# Altium project smps_nuc.PrjPcb
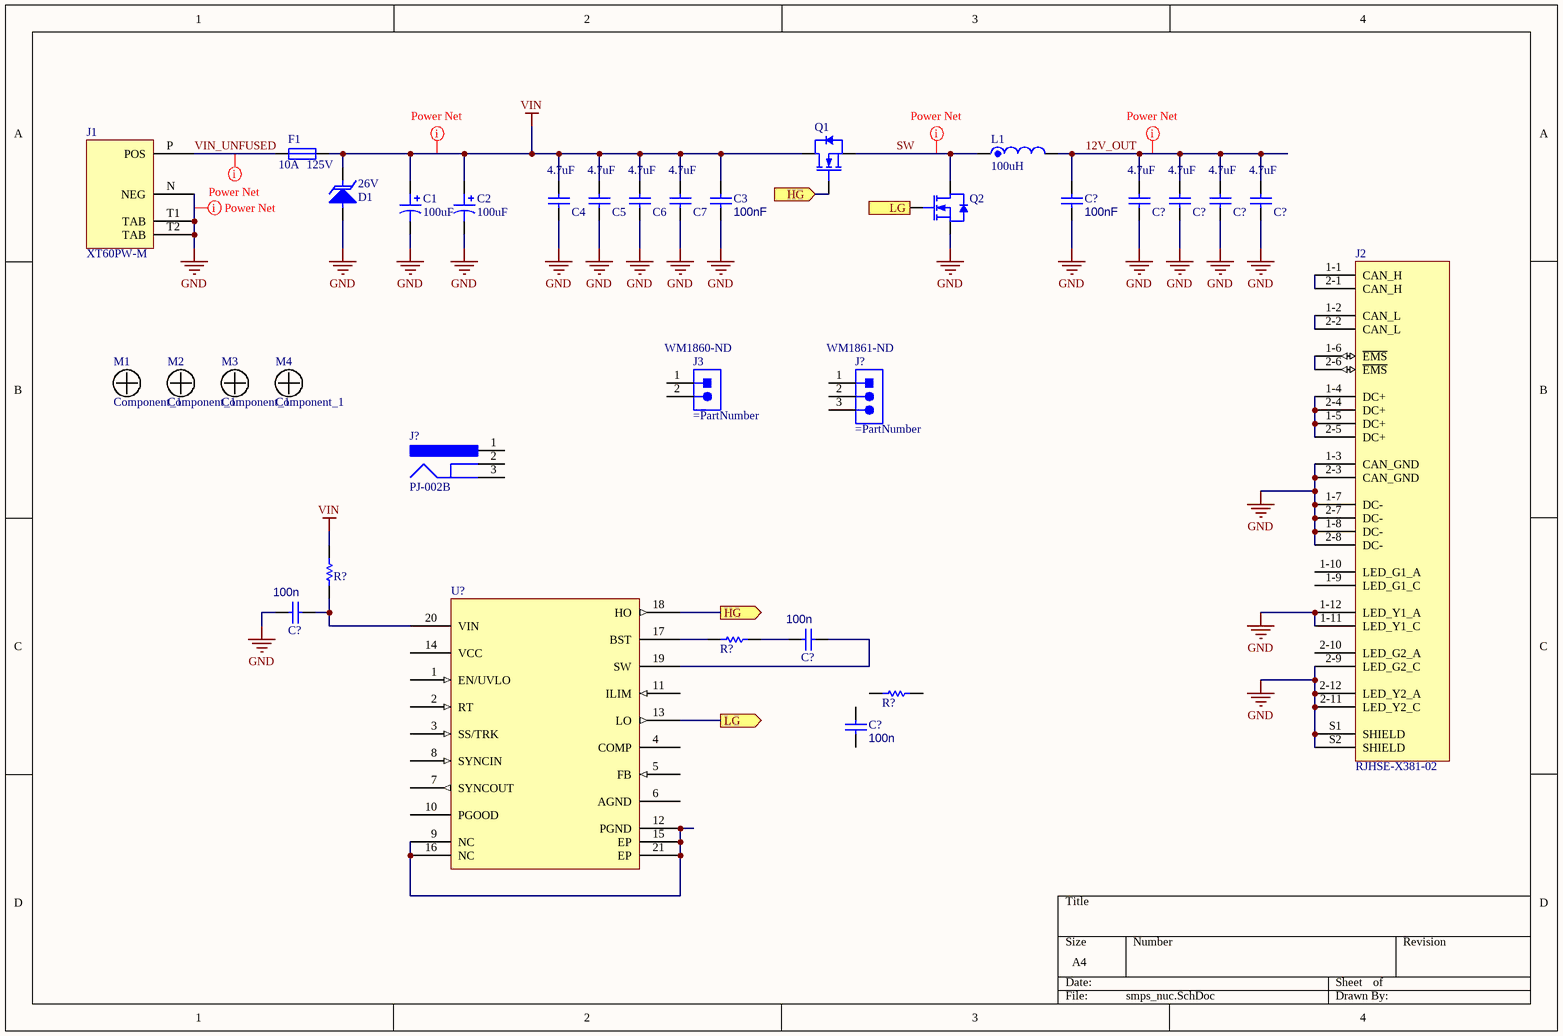
[diagram p0: smps_nuc.SchDoc]
1 sheet, 33 parts. Net scope: flat (ports and power ports of the same name join across sheets).
Board file: smps_nuc.PcbDoc

## Sheet smps_nuc.SchDoc
size A4

### Parts
(Parts that share a designator on the sheet are numbered #1, #2 ... from top to bottom, then left to right.)
C1  100uF  [CPOL_8x11_5_THRU]
C2  100uF  [CPOL_8x11_5_THRU]
C3  value 100nF  [CAPC1608X09N]
C4  Capacitance: 4.7uF  [C1210 (3225M)]
C5  Capacitance: 4.7uF  [C1210 (3225M)]
C6  Capacitance: 4.7uF  [C1210 (3225M)]
C7  Capacitance: 4.7uF  [C1210 (3225M)]
C?#1  Capacitance: 4.7uF  [C1210 (3225M)]
C?#2  Capacitance: 4.7uF  [C1210 (3225M)]
C?#3  Capacitance: 4.7uF  [C1210 (3225M)]
C?#4  Capacitance: 4.7uF  [C1210 (3225M)]
C?#5  value 100nF  [CAPC1608X09N]
C?#6  value 100n  [C1210 (3225M)]
C?#7  value 100n  [C1210 (3225M)]
C?#8  value 100n  [C1210 (3225M)]
D1  Reverse Standoff Voltage: 26V  [SMB]
F1  Fuse Current: 10A  Voltage Rating (AC): 125V  [Littelfuse_157]
J1  XT60PW-M  [XT60PW-M]
J2  RJHSE-X381-02  [RJHSE-X38X-02]
J3  Supplier Part Number 1: WM1860-ND  [43650-020X]
J?#1  Supplier Part Number 1: WM1861-ND  [43650-030X]
J?#2  PJ-002B  [CUI-PJ-002A_V]
L1  100uH  [SRP1265A]
M1  Component_1  [MOUNT_HOLE_3.2]
M2  Component_1  [MOUNT_HOLE_3.2]
M3  Component_1  [MOUNT_HOLE_3.2]
M4  Component_1  [MOUNT_HOLE_3.2]
Q1  MOSFET-N  [DFN-5 (SO-8FL)]  (value not drawn)
Q2  MOSFET-N  [DFN-5 (SO-8FL)]  (value not drawn)
R?#1  (no value)  [CR0603]
R?#2  (no value)  [CR0603]
R?#3  (no value)  [CR0603]
U?  (no value)  [RGY0020B_TI_N]

### Ports
HG (in), HG (out), LG (in), LG (out)

### Nets
GND: C1.2 C2.2 C3.2 C4.1 C5.1 C6.1 C7.1 C?#1.1 C?#2.1 C?#3.1 C?#4.1 C?#5.2 C?#6.2 D1.2(A) J1.N(NEG) J1.T1(TAB) J1.T2(TAB) J2.1-3(CAN_GND) J2.1-7(DC-) J2.1-8(DC-) J2.1-11(LED_Y1_C) J2.1-12(LED_Y1_A) J2.2-3(CAN_GND) J2.2-7(DC-) J2.2-8(DC-) J2.2-9(LED_G2_C) J2.2-11(LED_Y2_C) J2.2-12(LED_Y2_A) J2.S1(SHIELD) J2.S2(SHIELD) Q2.S
VIN: C1.1 C2.1 C3.1 C4.2 C5.2 C6.2 C7.2 D1.1(C) F1.2 Q1.D R?#1.2
12V_OUT: C?#1.2 C?#2.2 C?#3.2 C?#4.2 C?#5.1 L1.2
SW: L1.1 Q1.S Q2.D
VIN_UNFUSED: F1.1 J1.P(POS)
NetC?#6_1: C?#6.1 R?#1.1 U?.20(VIN)
NetC?#7_1: C?#7.1 U?.19(SW)
NetC?#7_2: C?#7.2 R?#2.2
NetJ2_1-1: J2.1-1(CAN_H) J2.2-1(CAN_H)
NetJ2_1-2: J2.1-2(CAN_L) J2.2-2(CAN_L)
NetJ2_1-4: J2.1-4(DC+) J2.1-5(DC+) J2.2-4(DC+) J2.2-5(DC+)
NetJ2_1-6: J2.1-6(~{EMS}) J2.2-6(~{EMS})
NetQ1_G: Q1.G U?.18(HO) ; port HG
NetQ2_G: Q2.G U?.13(LO) ; port LG
NetR?#2_1: R?#2.1 U?.17(BST)
NetU?_9: U?.9(NC) U?.12(PGND) U?.15(EP) U?.16(NC) U?.21(EP)

Not connected (* = marked no-connect by the designer): C?#8 1 2; J2 1-9(LED_G1_C) 1-10(LED_G1_A) 2-10(LED_G2_A); J3 1 2; J?#1 1 2 3; J?#2 1 2 3; R?#3 1 2; U? 1(EN/UVLO) 2(RT) 3(SS/TRK) 4(COMP) 5(FB) 6(AGND) 7(SYNCOUT) 8(SYNCIN) 10(PGOOD) 11(ILIM) 14(VCC)

### Layout directives
net class Power: 12V_OUT, GND, SW, VIN, VIN_UNFUSED

### Library data of the parts
C1 C2 = CPOL
C3 C?#5-C?#8 = C
C4-C7 C?#1-C?#4 = C: Ceramic capacitor 1210 X7R 50V 4.7uF; Manufacturer: Taiyo Yuden; Manufacturer Part Number: UMK325B7475MM-T; Tolerance: 20%; Supplier 1: Avnet; Supplier Part Number 1: UMK325B7475MM-T; RoHS: Yes; Category: Ceramic Capacitors; Pricing 1: 500=0.11860, 1000=0.10876, 2000=0.10029, 3000=0.09316, 5000=0.08688 (USD); Mount: Surface Mount; Case/Package: 1210; Case Code (Metric): 3225; Case Code (Imperial): 1210; Min Operating Temperature: -55°C; Max Operating Temperature: 125°C; Voltage Rating: 50V; Packaging: Tape and Reel; Dielectric: X7R; Voltage Rating (DC): 50V; Termination: SMD/SMT; Package Quantity: 500; Voltage: 50V; Length: 3.2mm; Height: 2.5mm; Width: 0.098inch; Thickness: 0.106inch; Depth: 2.5mm; Radiation Hardening: No; Halogen Free: Halogen Free; Lead Free: Lead Free; REACH SVHC: Unknown; ComponentLink1URL: https://datasheet.ciiva.com/2990/umk325b7475mm-t-ss-2990073.pdf?src-supplier=Avnet; ComponentLink1Description: https://datasheet.ciiva.com/2990/umk325b7475mm-t-ss-2990073.pdf?src-supplier=Avnet; ComponentLink2URL: https://datasheet.ciiva.com/141/umk325b7475mm-t-ss-141867.pdf?src-supplier=Digi-Key; ComponentLink2Description: https://datasheet.ciiva.com/141/umk325b7475mm-t-ss-141867.pdf?src-supplier=Digi-Key; ComponentLink3URL: https://datasheet.ciiva.com/5441/mlcc-all-e-541559-5441759.pdf?src-supplier=Mouser; ComponentLink3Description: https://datasheet.ciiva.com/5441/mlcc-all-e-541559-5441759.pdf?src-supplier=Mouser
D1 = TVS: TVS DIODE 26VWM 42.1VC SMB; Manufacturer: Diodes; Manufacturer Part Number: SMBJ26A-13-F; Clamping Voltage: 42.1V; Peak Pulse Power: 600W; Peak Pulse Current: 14.2A; Min Breakdown Voltage: 28.9V; Test Current: 1mA; Polarity: Unidirectional; Number of Unidirectional Channels: 1; Power Line Protection: No; Breakdown Voltage: 33.2V; Element Configuration: Single; Max Reverse Leakage Current: 5uA; Max Breakdown Voltage: 31.9V; Supplier 1: Digi-Key; RoHS: Yes; Category: TVS Diodes; Stock 1: 5829; Pricing 1: 1=0.41000, 10=0.30800, 25=0.27760, 100=0.14650, 250=0.14492, 500=0.12978, 1000=0.10100 (USD); Mount: Surface Mount; Case/Package: SMB; Number of Pins: 2; Contact Plating: Tin,Matte; Min Operating Temperature: -55°C; Max Operating Temperature: 150°C; Packaging: Tape and Reel; Package Quantity: 3000; Composition: Zener; Direction: Unidirectional; Max Surge Current: 14.2A; Termination: SMD/SMT; Reverse Breakdown Voltage: 28.9V; Leakage Current: 5uA; Number of Elements: 1; Max Power Dissipation: 600W; Voltage Rating (DC): 26V; Power Dissipation: 600W; Working Voltage: 26V; ESD Protection: No; Length: 4.57mm; Height: 2.62mm; Width: 3.9mm; Radiation Hardening: No; Lead Free: Lead Free; ComponentLink1URL: https://datasheet.ciiva.com/15143/getdatasheetpartid-118169-15143570.pdf?src-supplier=Verical; ComponentLink1Description: https://datasheet.ciiva.com/15143/getdatasheetpartid-118169-15143570.pdf?src-supplier=Verical; ComponentLink2URL: https://datasheet.ciiva.com/16211/ds19002-16211003.pdf?src-supplier=Future+Electronics; ComponentLink2Description: https://datasheet.ciiva.com/16211/ds19002-16211003.pdf?src-supplier=Future+Electronics
F1 = Littelfuse_157: FUSE CLIP W/ 10A FUSE, FAST ACTING - More Details; Manufacturer Part Number: 0157010.DR; DC Cold Resistance: 5.8mR; Fuse Type: Board Mount (Cartridge Style Excluded); Approvals: cULus,PSE; Supplier 1: Digi-Key; Supplier Part Number 1: F2973CT-ND; Manufacturer: Littelfuse; RoHS: Yes; Category: Fuses; Stock 1: 8274; Pricing 1: 1=2.73000, 5=2.60000, 10=2.47000, 50=1.99360, 100=1.69030, 250=1.64692, 500=1.38688 (USD); Mount: Surface Mount,Holder; Case/Package: SMD/SMT; Number of Pins: 2; Housing Material: Ceramic; Min Operating Temperature: -55°C; Max Operating Temperature: 125°C; Voltage Rating (DC): 125V; Current Rating: 10A; Packaging: Tape and Reel; Package Quantity: 1500; Resistance: 5.8mR; Length: 6.5mm; Height: 0.154inch; Depth: 3.7mm; Width: 0.146inch; Radiation Hardening: No; REACH SVHC: No SVHC; Lead Free: Lead Free; ComponentLink1URL: https://datasheet.ciiva.com/1221/682285-1221410.pdf?src-supplier=Newark; ComponentLink1Description: https://datasheet.ciiva.com/1221/682285-1221410.pdf?src-supplier=Newark; ComponentLink2URL: https://datasheet.ciiva.com/300/littelfuse-fuse-157-300246.pdf?src-supplier=Digi-Key; ComponentLink2Description: https://datasheet.ciiva.com/300/littelfuse-fuse-157-300246.pdf?src-supplier=Digi-Key; ComponentLink3URL: https://datasheet.ciiva.com/300/littelfuse-fuse-157-300247.pdf?src-supplier=Digi-Key; ComponentLink3Description: https://datasheet.ciiva.com/300/littelfuse-fuse-157-300247.pdf?src-supplier=Digi-Key; ComponentLink4URL: https://datasheet.ciiva.com/1268/479491-1268801.pdf?src-supplier=Element14; ComponentLink4Description: https://datasheet.ciiva.com/1268/479491-1268801.pdf?src-supplier=Element14; ComponentLink5URL: https://datasheet.ciiva.com/1268/littelfuse-fuse-157-1268995.pdf?src-supplier=Element14; ComponentLink5Description: https://datasheet.ciiva.com/1268/littelfuse-fuse-157-1268995.pdf?src-supplier=Element14; ComponentLink6URL: https://datasheet.ciiva.com/1272/479491-1272582.pdf?src-supplier=Farnell; ComponentLink6Description: https://datasheet.ciiva.com/1272/479491-1272582.pdf?src-supplier=Farnell; ComponentLink7URL: https://datasheet.ciiva.com/300/littelfuse-fuse-157-300248.pdf?src-supplier=Digi-Key; ComponentLink7Description: https://datasheet.ciiva.com/300/littelfuse-fuse-157-300248.pdf?src-supplier=Digi-Key; ComponentLink8URL: https://datasheet.ciiva.com/26845/getdatasheetpartid-343817-26845370.pdf?src-supplier=Verical; ComponentLink8Description: https://datasheet.ciiva.com/26845/getdatasheetpartid-343817-26845370.pdf?src-supplier=Verical; ComponentLink9URL: https://datasheet.ciiva.com/1272/littelfuse-fuse-157-1272878.pdf?src-supplier=Farnell; ComponentLink9Description: https://datasheet.ciiva.com/1272/littelfuse-fuse-157-1272878.pdf?src-supplier=Farnell
J1 = XT60PW-M: XT60, Male, THT, R/A
J3 = 43650-020X: MOLEX   43650-0200   HEADER, R/A, SINGLE ROW, 2 WAY; Number of Positions: 2; Connector Type: Plug,Socket; Contact Resistance: 10mR; Gender: Male; Current Rating: 5A; Voltage Rating (AC): 250V; Voltage Rating: 600V; Insulation Resistance: 1GR; Pitch: 3mm; Glow Wire Compliant: Compliant; Supplier 1: Digi-Key; Manufacturer: Molex; Manufacturer Part Number: 43650-0200; RoHS: Yes; Category: Headers and Wire Housings; Stock 1: 11922; Pricing 1: 1=0.96000, 10=0.84100, 100=0.72560, 500=0.59364, 1000=0.52768, 5000=0.46172, 10000=0.43863 (USD); Mount: Through Hole; Contact Plating: Tin; Contact Material: Brass,Tin; Color: Black; Housing Material: Thermoplastic; Housing Color: Black; Min Operating Temperature: -40°C; Max Operating Temperature: 105°C; Number of Rows: 1; Packaging: Tray; Termination: Solder; Number of Contacts: 2; Orientation: Right Angle; Package Quantity: 3927; Working Voltage: 250V; Number of Circuits: 2; Voltage Rating (DC): 250V; Length: 9.65mm; Height: 5.57mm; Depth: 9.9mm; Radiation Hardening: No; Flammability Rating: UL94 V-0; REACH SVHC: Unknown; Halogen Free: Low Halogen; Lead Free: Lead Free; ComponentLink1URL: https://datasheet.ciiva.com/14155/04402066-14155224.pdf?src-supplier=Distrelec; ComponentLink1Description: https://datasheet.ciiva.com/14155/04402066-14155224.pdf?src-supplier=Distrelec; ComponentLink2URL: https://datasheet.ciiva.com/5158/0436500200-pcb-headers-148844-5158523.pdf?src-supplier=Mouser; ComponentLink2Description: https://datasheet.ciiva.com/5158/0436500200-pcb-headers-148844-5158523.pdf?src-supplier=Mouser; ComponentLink3URL: https://datasheet.ciiva.com/11748/0900766b80d6135b-11748140.pdf?src-supplier=RSComponents; ComponentLink3Description: https://datasheet.ciiva.com/11748/0900766b80d6135b-11748140.pdf?src-supplier=RSComponents; ComponentLink4URL: https://datasheet.ciiva.com/22683/1709823-22683551.pdf?src-supplier=Element14; ComponentLink4Description: https://datasheet.ciiva.com/22683/1709823-22683551.pdf?src-supplier=Element14; ComponentLink5URL: https://datasheet.ciiva.com/30161/48630436500200-pcb-headers-30161343.pdf?src-supplier=Onlinecomponents.com; ComponentLink5Description: https://datasheet.ciiva.com/30161/48630436500200-pcb-headers-30161343.pdf?src-supplier=Onlinecomponents.com; ComponentLink6URL: https://datasheet.ciiva.com/9432/0436500200-pcb-headers-9432849.pdf?src-supplier=Avnet; ComponentLink6Description: https://datasheet.ciiva.com/9432/0436500200-pcb-headers-9432849.pdf?src-supplier=Avnet; ComponentLink7URL: https://datasheet.ciiva.com/16089/1029720436500200-pcb-headers-16089218.pdf?src-supplier=Onlinecomponents.com; ComponentLink7Description: https://datasheet.ciiva.com/16089/1029720436500200-pcb-headers-16089218.pdf?src-supplier=Onlinecomponents.com; ComponentLink8URL: https://datasheet.ciiva.com/7920/1839562-7920756.pdf?src-supplier=Element14; ComponentLink8Description: https://datasheet.ciiva.com/7920/1839562-7920756.pdf?src-supplier=Element14; ComponentLink9URL: https://datasheet.ciiva.com/19462/884053-19462312.pdf?src-supplier=Jameco; ComponentLink9Description: https://datasheet.ciiva.com/19462/884053-19462312.pdf?src-supplier=Jameco; ComponentLink10URL: https://datasheet.ciiva.com/16654/0436500200-pcb-headers-16654958.pdf?src-supplier=Avnet+Europe; ComponentLink10Description: https://datasheet.ciiva.com/16654/0436500200-pcb-headers-16654958.pdf?src-supplier=Avnet+Europe
J?#1 = 43650-030X: Conn Power HDR 3 POS 3mm Solder RA Thru-Hole 3 Terminal 1 Port Micro-Fit 3.0™ Tray; Manufacturer: Molex; Manufacturer Part Number: 0436500300; Number of Positions: 3; Connector Type: Male Pin; Contact Resistance: 10mR; Number of Ports: 1; Supplier 1: Digi-Key; RoHS: Yes; Category: Connectors; Stock 1: 19992; Pricing 1: 1=1.10000, 10=0.96400, 100=0.83160, 500=0.68040, 1000=0.60480, 5000=0.52920, 10000=0.50274 (USD); Mount: Through Hole; Housing Color: Black; Housing Material: Polymer; Color: Black; Contact Plating: Tin; Contact Material: Brass; Number of Terminals: 3; Min Operating Temperature: -40°C; Max Operating Temperature: 105°C; Orientation: Right Angle; Termination: Solder; Number of Rows: 1; Packaging: Tray; Fastening Type: Ramp; Length: 12.65mm; Pitch: 3mm; Depth: 9.9mm; ComponentLink1URL: https://datasheet.ciiva.com/6813/436500200-sd-6813974.pdf?src-supplier=Digi-Key; ComponentLink1Description: https://datasheet.ciiva.com/6813/436500200-sd-6813974.pdf?src-supplier=Digi-Key; ComponentLink2URL: https://datasheet.ciiva.com/10089/436500308-sd-10089990.pdf?src-supplier=Avnet; ComponentLink2Description: https://datasheet.ciiva.com/10089/436500308-sd-10089990.pdf?src-supplier=Avnet
J?#2 = CMP-2000-06895-1: Through Hole Right Angle DC Power Jack, 2.5 A, 2.5 mm Center Pin, 3 Position, -25 to 85 degC, RoHS, Bulk; Manufacturer: CUIInc.; Current Rating: 2.5A; Inside Contact Diameter: 2mm; Insulation Resistance: 50MOhms; Outside Contact Diameter: 6.5mm; Voltage Rating: 24V; Brand: CUI; Description: CONN PWR JACK 2.5X5.5MM SOLDER; Gender: Male; Shielding: Unshielded; Number of Conductors: 2; Operating Temperature Range: -25Cto+85C; Mounting Technology: ThroughHole; Connector Type: DCPowerJack; Contact Material: Copper; Datasheet URL: http://www.cui.com/product/resource/pj-002a.pdf; Contact Gender: Male; Housing Material: PolybutyleneTerephthalate(PBT); Manufacturer URL: http://www.cui.com/; Package Reference: PJ-002A; Mounting Style: ThroughHole; Mounting Angle: Right; Product Category: DCPowerConnectors; Product: Jacks; Flammability Rating: UL94V-0; Contact Plating: Nickel; RoHS: True; Datasheet Version: Rev. 1.03, 04/2016; Package Description: 3-Pin Through Hole Device, Body 14.4 x 9 mm, Height 11 mm; Factory Pack Quantity: 500; Termination Style: ThroughHole; Supplier 1: Digi-Key; Supplier Part Number 1: CP-002B-ND; Manufacturer Part Number: PJ-002B; Category: Connectors; Stock 1: 14399; Pricing 1: 1=0.60000, 10=0.55800, 25=0.50240, 50=0.44640, 100=0.42780, 250=0.39060, 500=0.37200, 1000=0.30690, 2500=0.27900 (USD); Mount: Through Hole; Color: Black; Housing Color: Black; Min Operating Temperature: -25°C; Max Operating Temperature: 85°C; Termination: Through Hole; Package Quantity: 500; Orientation: Horizontal; Packaging: Bulk; Diameter: 2.5mm; Lead Free: Lead Free; ComponentLink1URL: http://www.mouser.com/ds/2/670/pj-002b-515833.pdf?src-supplier=Mouser; ComponentLink1Description: http://www.mouser.com/ds/2/670/pj-002b-515833.pdf?src-supplier=Mouser; ComponentLink2URL: http://www.cui.com/Product/Resource/FuturePDF/PJ-002B.pdf?src-supplier=Future+Electronics; ComponentLink2Description: http://www.cui.com/Product/Resource/FuturePDF/PJ-002B.pdf?src-supplier=Future+Electronics; ComponentLink3URL: https://www.cui.com/product/resource/digikeypdf/pj-002b.pdf?src-supplier=Digi-Key; ComponentLink3Description: https://www.cui.com/product/resource/digikeypdf/pj-002b.pdf?src-supplier=Digi-Key
L1 = L
R?#1-R?#3 = R
U? = LM25145